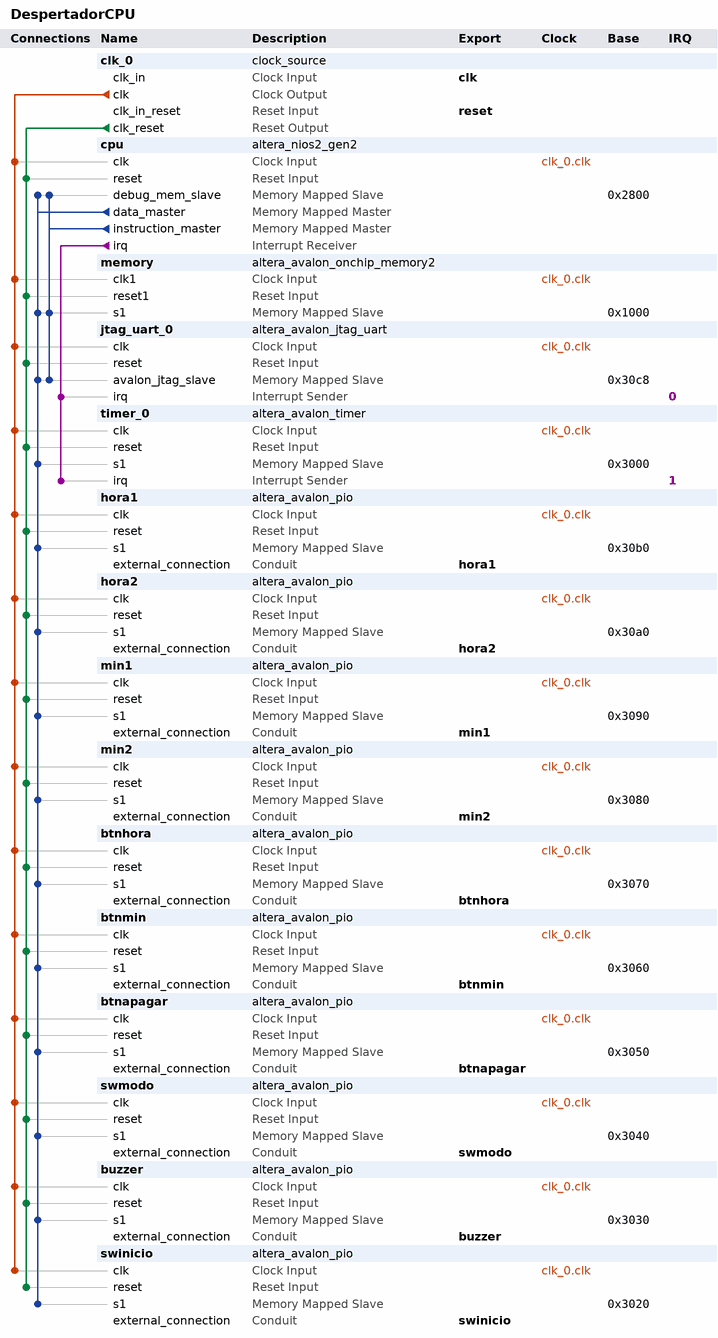
[diagram p0: system contents]
# Platform Designer (Qsys) system DespertadorCPU, Cyclone V 5CSEMA5F31C6
# Parameters at their usual value, and those the tool derives, are not listed.
package require -exact qsys 18.1
create_system DespertadorCPU
set_project_property DEVICE_FAMILY {Cyclone V}
set_project_property DEVICE 5CSEMA5F31C6

add_instance clk_0 clock_source 18.1
set_instance_parameter_value clk_0 clockFrequency 50000000

add_instance cpu altera_nios2_gen2 18.1
set_instance_parameter_value cpu dcache_size 2048
set_instance_parameter_value cpu exceptionSlave memory.s1
set_instance_parameter_value cpu icache_size 4096
set_instance_parameter_value cpu impl Tiny
set_instance_parameter_value cpu resetSlave memory.s1

add_instance memory altera_avalon_onchip_memory2 18.1
set_instance_parameter_value memory dataWidth 32
set_instance_parameter_value memory dualPort false
set_instance_parameter_value memory initMemContent true
set_instance_parameter_value memory initializationFileName onchip_mem.hex
set_instance_parameter_value memory memorySize 4096

add_instance jtag_uart_0 altera_avalon_jtag_uart 18.1
set_instance_parameter_value jtag_uart_0 simInteractiveOptions NO_INTERACTIVE_WINDOWS

add_instance timer_0 altera_avalon_timer 18.1
set_instance_parameter_value timer_0 period 1
set_instance_parameter_value timer_0 periodUnits SEC

add_instance hora1 altera_avalon_pio 18.1
set_instance_parameter_value hora1 direction Output
set_instance_parameter_value hora1 width 7

add_instance hora2 altera_avalon_pio 18.1
set_instance_parameter_value hora2 direction Output
set_instance_parameter_value hora2 width 7

add_instance min1 altera_avalon_pio 18.1
set_instance_parameter_value min1 direction Output
set_instance_parameter_value min1 width 7

add_instance min2 altera_avalon_pio 18.1
set_instance_parameter_value min2 direction Output
set_instance_parameter_value min2 width 7

add_instance btnhora altera_avalon_pio 18.1
set_instance_parameter_value btnhora direction Input
set_instance_parameter_value btnhora width 1

add_instance btnmin altera_avalon_pio 18.1
set_instance_parameter_value btnmin direction Input
set_instance_parameter_value btnmin width 1

add_instance btnapagar altera_avalon_pio 18.1
set_instance_parameter_value btnapagar direction Input
set_instance_parameter_value btnapagar width 1

add_instance swmodo altera_avalon_pio 18.1
set_instance_parameter_value swmodo direction Input
set_instance_parameter_value swmodo width 1

add_instance buzzer altera_avalon_pio 18.1
set_instance_parameter_value buzzer direction Output
set_instance_parameter_value buzzer width 1

add_instance swinicio altera_avalon_pio 18.1
set_instance_parameter_value swinicio direction Input
set_instance_parameter_value swinicio width 1

# connections
add_connection clk_0.clk btnapagar.clk clock
add_connection clk_0.clk btnhora.clk clock
add_connection clk_0.clk btnmin.clk clock
add_connection clk_0.clk buzzer.clk clock
add_connection clk_0.clk cpu.clk clock
add_connection clk_0.clk hora1.clk clock
add_connection clk_0.clk hora2.clk clock
add_connection clk_0.clk jtag_uart_0.clk clock
add_connection clk_0.clk memory.clk1 clock
add_connection clk_0.clk min1.clk clock
add_connection clk_0.clk min2.clk clock
add_connection clk_0.clk swinicio.clk clock
add_connection clk_0.clk swmodo.clk clock
add_connection clk_0.clk timer_0.clk clock
add_connection clk_0.clk_reset btnapagar.reset reset
add_connection clk_0.clk_reset btnhora.reset reset
add_connection clk_0.clk_reset btnmin.reset reset
add_connection clk_0.clk_reset buzzer.reset reset
add_connection clk_0.clk_reset cpu.reset reset
add_connection clk_0.clk_reset hora1.reset reset
add_connection clk_0.clk_reset hora2.reset reset
add_connection clk_0.clk_reset jtag_uart_0.reset reset
add_connection clk_0.clk_reset memory.reset1 reset
add_connection clk_0.clk_reset min1.reset reset
add_connection clk_0.clk_reset min2.reset reset
add_connection clk_0.clk_reset swinicio.reset reset
add_connection clk_0.clk_reset swmodo.reset reset
add_connection clk_0.clk_reset timer_0.reset reset
add_connection cpu.data_master btnapagar.s1 avalon
set_connection_parameter_value cpu.data_master/btnapagar.s1 baseAddress 0x3050
add_connection cpu.data_master btnhora.s1 avalon
set_connection_parameter_value cpu.data_master/btnhora.s1 baseAddress 0x3070
add_connection cpu.data_master btnmin.s1 avalon
set_connection_parameter_value cpu.data_master/btnmin.s1 baseAddress 0x3060
add_connection cpu.data_master buzzer.s1 avalon
set_connection_parameter_value cpu.data_master/buzzer.s1 baseAddress 0x3030
add_connection cpu.data_master cpu.debug_mem_slave avalon
set_connection_parameter_value cpu.data_master/cpu.debug_mem_slave baseAddress 0x2800
add_connection cpu.data_master hora1.s1 avalon
set_connection_parameter_value cpu.data_master/hora1.s1 baseAddress 0x30b0
add_connection cpu.data_master hora2.s1 avalon
set_connection_parameter_value cpu.data_master/hora2.s1 baseAddress 0x30a0
add_connection cpu.data_master jtag_uart_0.avalon_jtag_slave avalon
set_connection_parameter_value cpu.data_master/jtag_uart_0.avalon_jtag_slave baseAddress 0x30c8
add_connection cpu.data_master memory.s1 avalon
set_connection_parameter_value cpu.data_master/memory.s1 baseAddress 0x1000
add_connection cpu.data_master min1.s1 avalon
set_connection_parameter_value cpu.data_master/min1.s1 baseAddress 0x3090
add_connection cpu.data_master min2.s1 avalon
set_connection_parameter_value cpu.data_master/min2.s1 baseAddress 0x3080
add_connection cpu.data_master swinicio.s1 avalon
set_connection_parameter_value cpu.data_master/swinicio.s1 baseAddress 0x3020
add_connection cpu.data_master swmodo.s1 avalon
set_connection_parameter_value cpu.data_master/swmodo.s1 baseAddress 0x3040
add_connection cpu.data_master timer_0.s1 avalon
set_connection_parameter_value cpu.data_master/timer_0.s1 baseAddress 0x3000
add_connection cpu.instruction_master cpu.debug_mem_slave avalon
set_connection_parameter_value cpu.instruction_master/cpu.debug_mem_slave baseAddress 0x2800
add_connection cpu.instruction_master jtag_uart_0.avalon_jtag_slave avalon
set_connection_parameter_value cpu.instruction_master/jtag_uart_0.avalon_jtag_slave baseAddress 0x30c8
add_connection cpu.instruction_master memory.s1 avalon
set_connection_parameter_value cpu.instruction_master/memory.s1 baseAddress 0x1000
add_connection cpu.irq jtag_uart_0.irq interrupt
set_connection_parameter_value cpu.irq/jtag_uart_0.irq irqNumber 0
add_connection cpu.irq timer_0.irq interrupt
set_connection_parameter_value cpu.irq/timer_0.irq irqNumber 1

# exported interfaces
add_interface btnapagar conduit end
set_interface_property btnapagar EXPORT_OF btnapagar.external_connection
add_interface btnhora conduit end
set_interface_property btnhora EXPORT_OF btnhora.external_connection
add_interface btnmin conduit end
set_interface_property btnmin EXPORT_OF btnmin.external_connection
add_interface buzzer conduit end
set_interface_property buzzer EXPORT_OF buzzer.external_connection
add_interface clk clock sink
set_interface_property clk EXPORT_OF clk_0.clk_in
add_interface hora1 conduit end
set_interface_property hora1 EXPORT_OF hora1.external_connection
add_interface hora2 conduit end
set_interface_property hora2 EXPORT_OF hora2.external_connection
add_interface min1 conduit end
set_interface_property min1 EXPORT_OF min1.external_connection
add_interface min2 conduit end
set_interface_property min2 EXPORT_OF min2.external_connection
add_interface reset reset sink
set_interface_property reset EXPORT_OF clk_0.clk_in_reset
add_interface swinicio conduit end
set_interface_property swinicio EXPORT_OF swinicio.external_connection
add_interface swmodo conduit end
set_interface_property swmodo EXPORT_OF swmodo.external_connection

set_interconnect_requirement {$system} qsys_mm.clockCrossingAdapter HANDSHAKE
set_interconnect_requirement {$system} qsys_mm.enableEccProtection FALSE
set_interconnect_requirement {$system} qsys_mm.insertDefaultSlave FALSE
set_interconnect_requirement {$system} qsys_mm.maxAdditionalLatency 1

save_system DespertadorCPU.qsys
